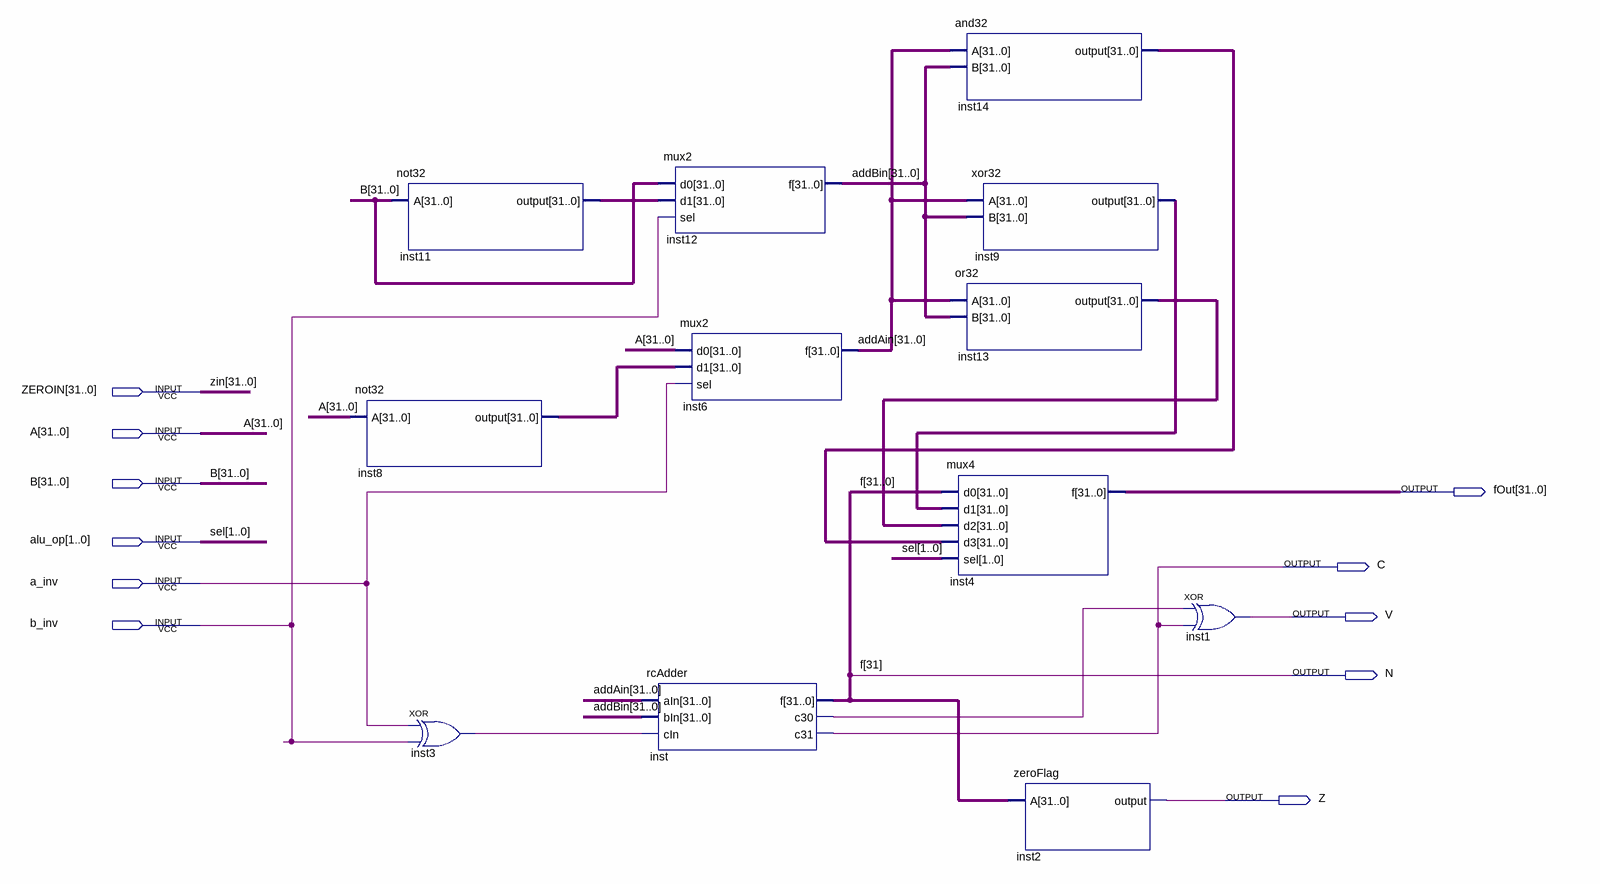
[diagram p0: schematic sheet]
// Quartus schematic SomeAssemblyRequired_lab7.bdf as structural Verilog: 12 symbols, 11 pins
module SomeAssemblyRequired_lab7 (
  input  [31:0] ZEROIN,
  input  [31:0] A,
  input  [31:0] B,
  input  [1:0] alu_op,
  input  a_inv,
  input  b_inv,
  output [31:0] fOut,
  output C,
  output V,
  output N,
  output Z
);

  wire inst3_out, inst_c30;
  wire [30:0] f;
  wire [31:0] addAin, addBin, inst8_output, inst9_output, inst11_output, inst13_output, inst14_output;

  not32 inst8 (.A(A), .\output (inst8_output));
  not32 inst11 (.A(B), .\output (inst11_output));
  xor inst3 (inst3_out, a_inv, b_inv);
  mux2 inst12 (.d0(B), .d1(inst11_output), .sel(b_inv), .f(addBin));
  mux2 inst6 (.d0(A), .d1(inst8_output), .sel(a_inv), .f(addAin));
  rcAdder inst (.aIn(addAin), .bIn(addBin), .cIn(inst3_out), .f({N, f}), .c30(inst_c30), .c31(C));
  and32 inst14 (.A(addAin), .B(addBin), .\output (inst14_output));
  or32 inst13 (.A(addAin), .B(addBin), .\output (inst13_output));
  mux4 inst4 (.d0({N, f}), .d1(inst9_output), .d2(inst13_output), .d3(inst14_output), .sel(alu_op), .f(fOut));
  xor32 inst9 (.A(addAin), .B(addBin), .\output (inst9_output));
  zeroFlag inst2 (.A({N, f}), .\output (Z));
  xor inst1 (V, inst_c30, C);

  // Other names for the same wires on the sheet: f[31] = N; sel[1:0] = alu_op; zin[31:0] = ZEROIN
endmodule
